# Altium schematic sheet Connectors.SchDoc
size A4; SheetNumber: 6; SheetTotal: 9
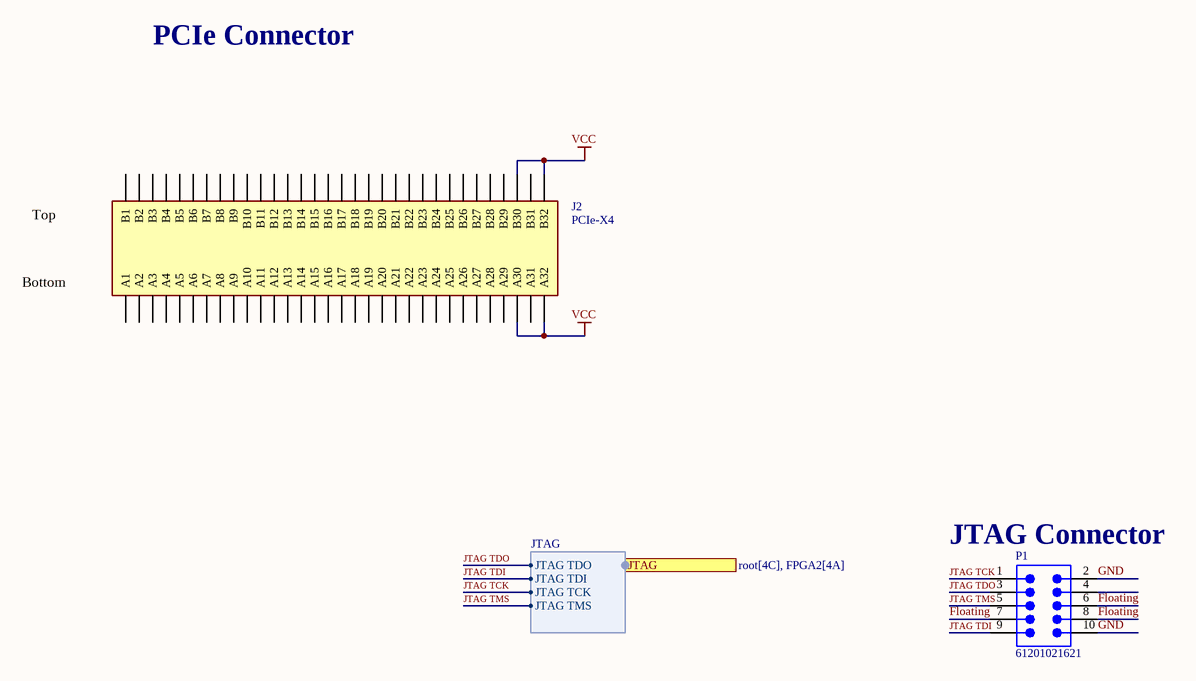
[diagram p0: Connectors.SchDoc]

## Parts
J2  PCIe-X4  [BUS_PCIexpress_x4]  (no BOM)
P1  61201021621  [61201021621]

## Ports
JTAG (harness JTAG, see root[4C], FPGA2[4A])

## Harnesses
JTAG: JTAG TDO, JTAG TDI, JTAG TCK, JTAG TMS

## Nets
VCC: J2.A30 J2.A32 J2.B30 J2.B32
Floating: P1.6 P1.7 P1.8
GND: P1.2 P1.10
JTAG TCK: P1.1 ; port JTAG.JTAG TCK
JTAG TDI: P1.9 ; port JTAG.JTAG TDI
JTAG TDO: P1.3 ; port JTAG.JTAG TDO
JTAG TMS: P1.5 ; port JTAG.JTAG TMS

Not connected (* = marked no-connect by the designer): J2 A1 A2 A3 A4 A5 A6 A7 A8 A9 A10 A11 A12 A13 A14 A15 A16 A17 A18 A19 A20 A21 A22 A23 A24 A25 A26 A27 A28 A29 A31 B1 B2 B3 B4 B5 B6 B7 B8 B9 B10 B11 B12 B13 B14 B15 B16 B17 B18 B19 B20 B21 B22 B23 B24 B25 B26 B27 B28 B29 B31; P1 4

## Notes on the sheet
- PCIe Connector
- Top
- Bottom
- (near P1) JTAG Connector

## Library data of the parts
P1 = CMP-1502-00007-2: NexarPartId: 8917783; Number of Contacts: 10; Voltage Rating (DC): 250V; Insulation Resistance: 1GΩ; Current Rating: 3A; Row Spacing: 2.54mm; Contact Resistance: 20mΩ; Connector Type: Male Pin; Gender: Male; Flammability Rating: UL94 V-0; Termination: Solder; Width: 20.36mm; Length: 20.36mm; Housing Material: PBT; Operating Supply Voltage: 250V; Min Operating Temperature: -40°C; Lead Free: Lead Free; Insulation Material: PBT; Orientation: Vertical; RoHS: Compliant; Voltage Rating: 250V; Number of Pins: 10; Height: 8.85mm; REACH SVHC: Unknown; Contact Material: Copper; Contact Gender: Male; Color: Black; Mount: Through Hole; Contact Plating: Gold; Lead Pitch: 2.54mm; Number of Positions: 10; Pitch: 2.54mm; Max Operating Temperature: 105°C; Number of Rows: 2